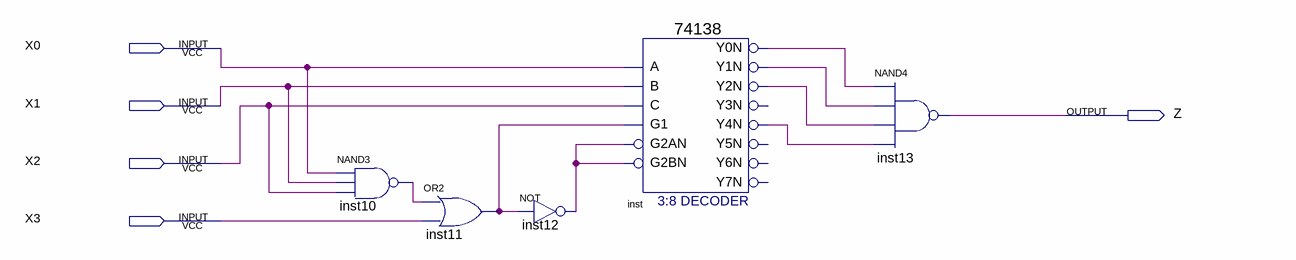
[diagram p0: schematic sheet]
// Quartus schematic Detector.bdf as structural Verilog: 5 symbols, 5 pins
module Detector (
  input  X0,
  input  X1,
  input  X2,
  input  X3,
  output Z
);

  wire inst10_out, inst11_out, inst12_out, inst_y0n, inst_y1n, inst_y2n, inst_y4n;

  nand inst10 (inst10_out, X0, X1, X2);
  or inst11 (inst11_out, inst10_out, X3);
  not inst12 (inst12_out, inst11_out);
  \74138  inst (
    .A(X0), .B(X1), .G1(inst11_out), .C(X2), .G2AN(inst12_out), .G2BN(inst12_out), .Y0N(inst_y0n),
    .Y1N(inst_y1n), .Y2N(inst_y2n), .Y4N(inst_y4n));  // open: Y3N, Y5N, Y6N, Y7N
  nand inst13 (Z, inst_y0n, inst_y1n, inst_y2n, inst_y4n);
endmodule
